# Altium schematic sheet RTL8201CP.SchDoc
size A4
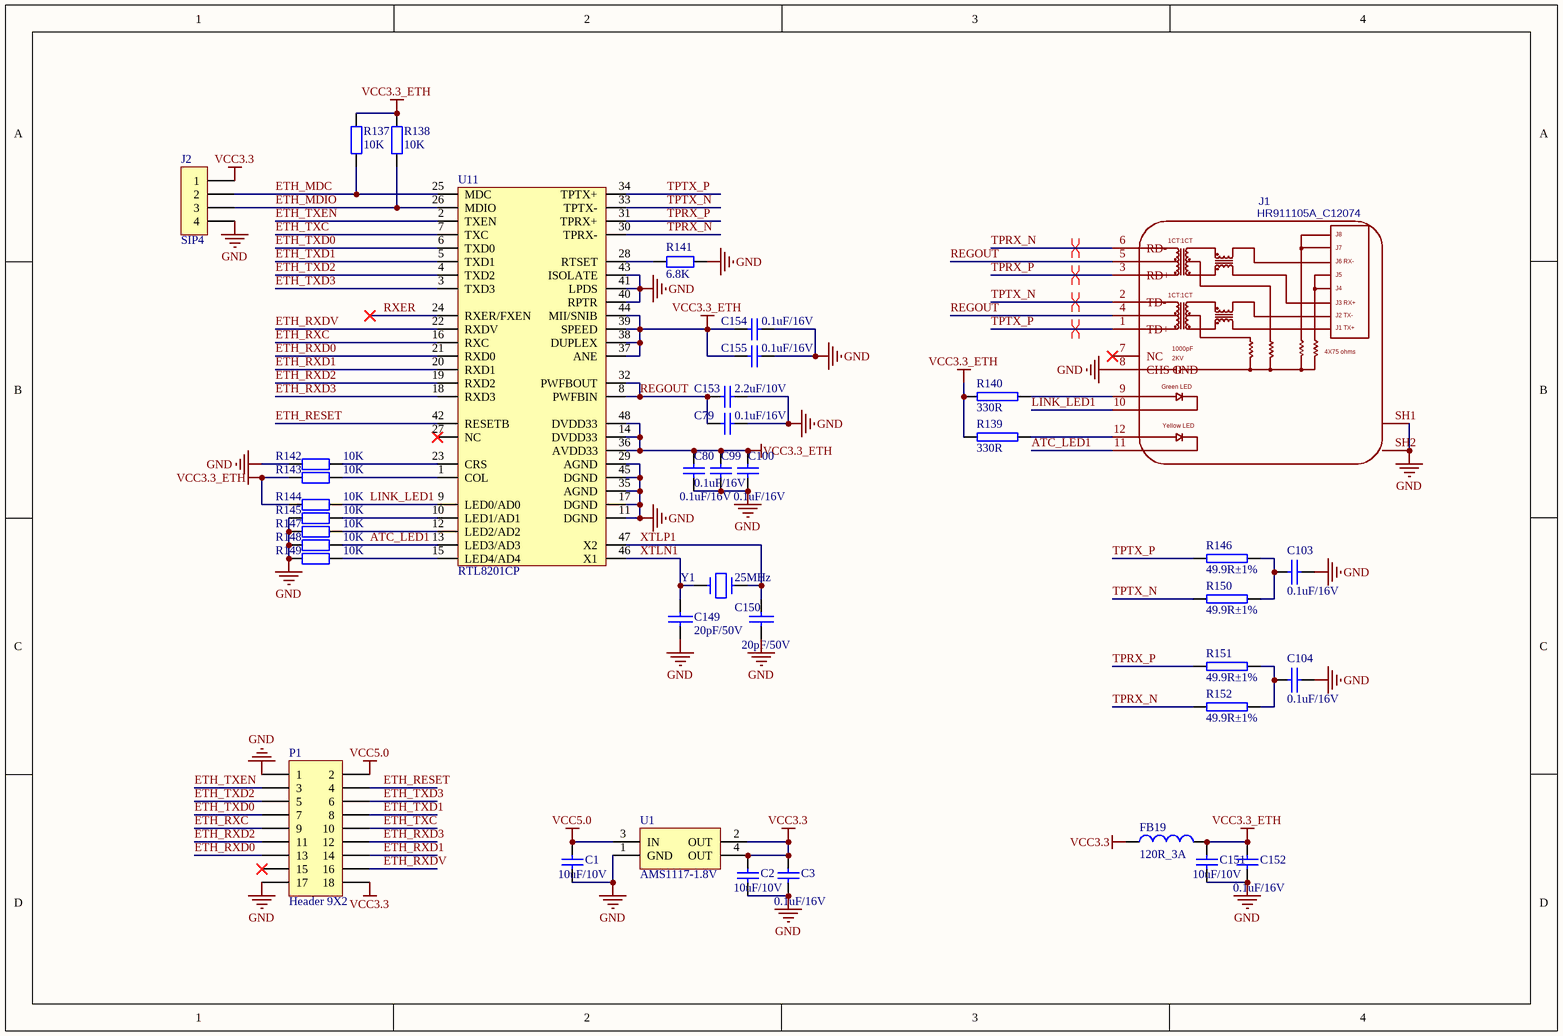
[diagram p0: RTL8201CP.SchDoc]

## Parts
C1  10uF/10V  [0402C]
C2  10uF/10V  [0402C]
C3  0.1uF/16V  [0402C]
C79  0.1uF/16V  [0402C]
C80  0.1uF/16V  [0402C]
C99  0.1uF/16V  [0402C]
C100  0.1uF/16V  [0402C]
C103  0.1uF/16V  [0402C]
C104  0.1uF/16V  [0402C]
C149  20pF/50V  [0402C]
C150  20pF/50V  [0402C]
C151  10uF/10V  [0402C]
C152  0.1uF/16V  [0402C]
C153  2.2uF/10V  [0402C]
C154  0.1uF/16V  [0402C]
C155  0.1uF/16V  [0402C]
FB19  120R_3A  [0603]
J1  HR911105A_C12074  [RJ45-TH_HR911105A]
J2  SIP4  [SIP4]
P1  Header 9X2  [HDR2X9]
R137  10K  [0402R]
R138  10K  [0402R]
R139  330R  [0402R]
R140  330R  [0402R]
R141  6.8K  [0402R]
R142  10K  [0402R]
R143  10K  [0402R]
R144  10K  [0402R]
R145  10K  [0402R]
R146  49.9R±1%  [0402R]
R147  10K  [0402R]
R148  10K  [0402R]
R149  10K  [0402R]
R150  49.9R±1%  [0402R]
R151  49.9R±1%  [0402R]
R152  49.9R±1%  [0402R]
U1  AMS1117-1.8V  [SOT-223]
U11  RTL8201CP  [LQFP48S]
Y1  25MHz  [HC-49S]

## Nets
GND: C1.1 C2.1 C3.1 C79.1 C80.1 C99.1 C100.1 C103.1 C104.1 C149.2 C150.1 C151.1 C152.1 C153.1 C154.1 C155.1 J1.8(CHS_GND) J1.SH1 J1.SH2 J2.4 P1.1 P1.17 R141.1 R142.2 R145.2 R147.2 R148.2 R149.2 U1.1(GND) U11.11(DGND) U11.17(DGND) U11.29(AGND) U11.35(AGND) U11.40(RPTR) U11.41(LPDS) U11.43(ISOLATE) U11.45(DGND)
VCC3.3: C2.2 C3.2 FB19.1 J2.1 P1.18 U1.2(OUT) U1.4(OUT)
VCC3.3_ETH: C80.2 C99.2 C100.2 C151.2 C152.2 C154.2 C155.2 FB19.2 R137.2 R138.2 R139.2 R140.2 R143.2 R144.2 U11.14(DVDD33) U11.36(AVDD33) U11.37(ANE) U11.38(DUPLEX) U11.39(SPEED) U11.44(MII/SNIB) U11.48(DVDD33)
VCC5.0: C1.2 P1.2 U1.3(IN)
ATC_LED1: J1.11 R148.1 U11.13(LED3/AD3)
ETH_MDC: J2.2 R137.1 U11.25(MDC)
ETH_MDIO: J2.3 R138.1 U11.26(MDIO)
ETH_RESET: P1.4 U11.42(RESETB)
ETH_RXC: P1.9 U11.16(RXC)
ETH_RXD0: P1.13 U11.21(RXD0)
ETH_RXD1: P1.14 U11.20(RXD1)
ETH_RXD2: P1.11 U11.19(RXD2)
ETH_RXD3: P1.12 U11.18(RXD3)
ETH_RXDV: P1.16 U11.22(RXDV)
ETH_TXC: P1.10 U11.7(TXC)
ETH_TXD0: P1.7 U11.6(TXD0)
ETH_TXD1: P1.8 U11.5(TXD1)
ETH_TXD2: P1.5 U11.4(TXD2)
ETH_TXD3: P1.6 U11.3(TXD3)
ETH_TXEN: P1.3 U11.2(TXEN)
LINK_LED1: J1.10 R144.1 U11.9(LED0/AD0)
REGOUT: C79.2 C153.2 J1.4 J1.5 U11.8(PWFBIN) U11.32(PWFBOUT)
RXER: U11.24(RXER/FXEN)
TPRX_N: J1.6(RD-) R152.2 U11.30(TPRX-)
TPRX_P: J1.3(RD+) R151.2 U11.31(TPRX+)
TPTX_N: J1.2(TD-) R150.2 U11.33(TPTX-)
TPTX_P: J1.1(TD+) R146.2 U11.34(TPTX+)
XTLN1: C149.1 U11.46(X1) Y1.1
XTLP1: C150.2 U11.47(X2) Y1.2
NetC103_2: C103.2 R146.1 R150.1
NetC104_2: C104.2 R151.1 R152.1
NetJ1_9: J1.9 R140.1
NetJ1_12: J1.12 R139.1
NetR141_2: R141.2 U11.28(RTSET)
NetR142_1: R142.1 U11.23(CRS)
NetR143_1: R143.1 U11.1(COL)
NetR145_1: R145.1 U11.10(LED1/AD1)
NetR147_1: R147.1 U11.12(LED2/AD2)
NetR149_1: R149.1 U11.15(LED4/AD4)

Not connected (* = marked no-connect by the designer): J1 7(NC)*; P1 15*; U11 27(NC)*

## Layout directives
differential pair: TPRX_N, TPRX_P, TPTX_N, TPTX_P

## Notes on the sheet
- (in symbol HR911105A_C12074) J8; 1CT:1CT; J7; J6 RX-; J5; J4; J3 RX+; J2 TX-; J1 TX+; 1000pF; 4X75 ohms; 2KV; Green LED; Yellow LED

## Library data of the parts
C1 C2 C151 = CT41-25V-0805-106: 10uF_10%_X5R_25V
C3 C79 C80 C99 C100 C152-C155 = CT41-50V-0805-104: 0.1uF_10%_X5R_50V
C103 C104 C149 C150 = CAP: Capacitor
FB19 = FB-90R-100Mhz
J1 = HR911105A_C12074: BOM_Manufacturer: HANRUN; BOM_Paste Type: expand; BOM_Supplier: LCSC; BOM_Manufacturer Part: HR911105A; image: //image.lceda.cn/szlcsc/C12074.jpg; BOM_Supplier Part: C12074; spicePre: J; spiceSymbolName: HR911105A_C12074
J2 = CON4
P1 = Header 9X2: Header, 9-Pin, Dual row; LatestRevisionDate: 17-Jul-2002; LatestRevisionNote: Re-released for DXP Platform.; Publisher: Altium Limited
R137 R138 R141-R145 R147-R149 = RC-0805-0R: 0R_5%_1/16W
R139 R140 R146 R150-R152 = RES
U1 = AMS1117-1.8V: 稳压器1.8V
U11 = RTL8201CP: ETH PHY
Y1 = CRYES